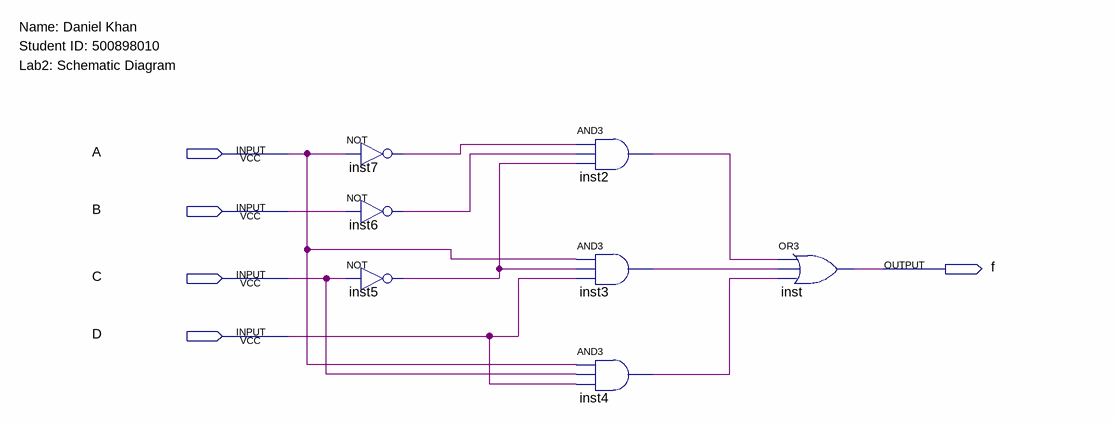
[diagram p0: schematic sheet]
// Quartus schematic Lab2schm.bdf as structural Verilog: 7 symbols, 5 pins
module Lab2schm (
  input  A,
  input  B,
  input  C,
  input  D,
  output f
);

  wire inst2_out, inst3_out, inst4_out, inst5_out, inst6_out, inst7_out;

  not inst7 (inst7_out, A);
  not inst6 (inst6_out, B);
  not inst5 (inst5_out, C);
  and inst2 (inst2_out, inst7_out, inst6_out, inst5_out);
  and inst3 (inst3_out, A, inst5_out, D);
  and inst4 (inst4_out, A, C, D);
  or inst (f, inst2_out, inst3_out, inst4_out);

  // Notes on the sheet:
  //   Name: Daniel Khan
  //   Student ID: 500898010
  //   Lab2: Schematic Diagram
endmodule
